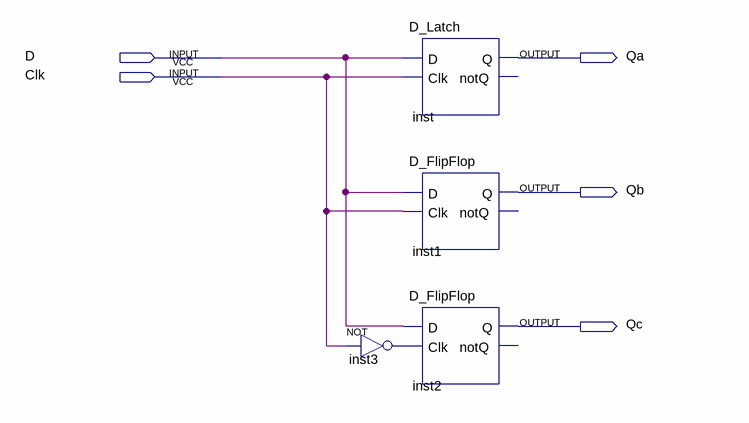
[diagram p0: schematic sheet]
// Quartus schematic D_comparison.bdf as structural Verilog: 4 symbols, 5 pins
module D_comparison (
  input  D,
  input  Clk,
  output Qa,
  output Qb,
  output Qc
);

  wire inst3_out;

  not inst3 (inst3_out, Clk);
  D_Latch inst (.D(D), .Clk(Clk), .Q(Qa));  // open: notQ
  D_FlipFlop inst1 (.D(D), .Clk(Clk), .Q(Qb));  // open: notQ
  D_FlipFlop inst2 (.D(D), .Clk(inst3_out), .Q(Qc));  // open: notQ
endmodule
